# Altium schematic sheet deel2.SchDoc
size A4; SheetNumber: 2; SheetTotal: 3
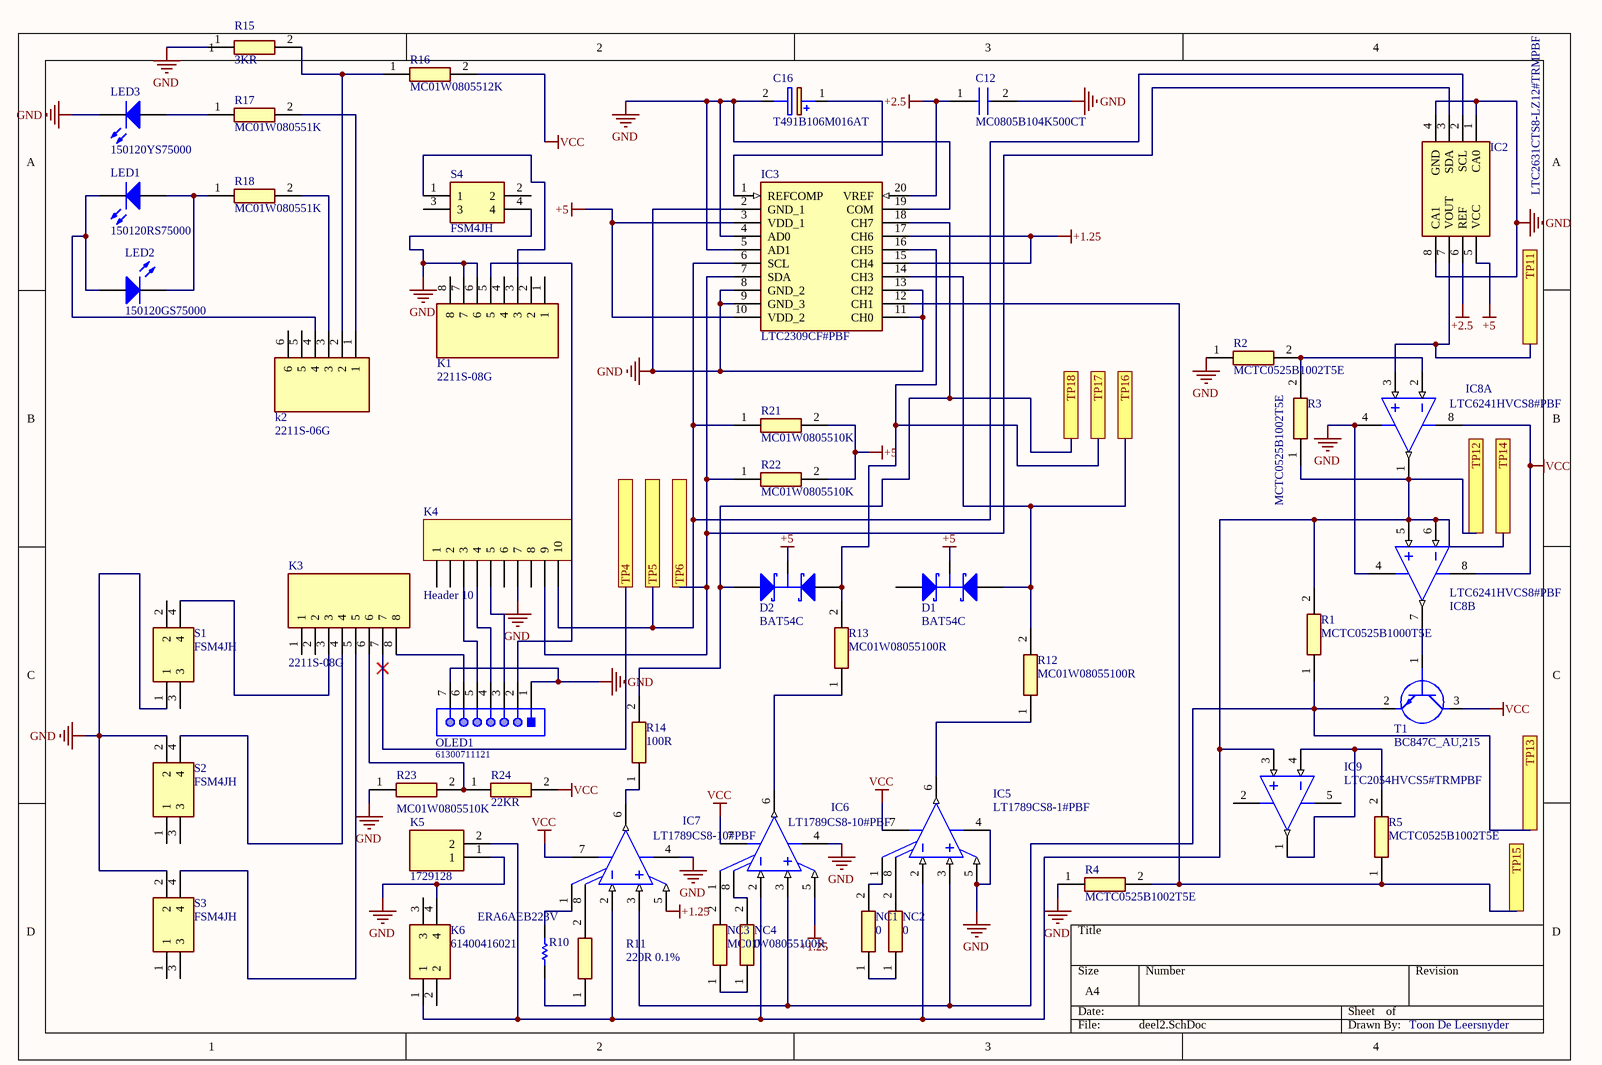
[diagram p0: deel2.SchDoc]

## Parts
C12  MC0805B104K500CT  [CAPC2012X90N]
C16  T491B106M016AT  [CAPPM3528X210N]
D1  BAT54C  [NXP-SOT23-3_V]
D2  BAT54C  [NXP-SOT23-3_V]
IC2  LTC2631CTS8-LZ12#TRMPBF  [SOT65P280X100-8N]
IC3  LTC2309CF#PBF  [SOP65P640X110-20N]
IC5  LT1789CS8-1#PBF  [LT-S8-8_N]
IC6  LT1789CS8-10#PBF  [LT-S8-8_N]
IC7  LT1789CS8-10#PBF  [LT-S8-8_N]
IC8  LTC6241HVCS8#PBF  [LT-S8-8_M]  (parts A,B of 2)
IC9  LTC2054HVCS5#TRMPBF  [LT-S5-5-TSOT-23_N]
K1  2211S-08G  [HDRV8W64P0X254_1X8_2032X254X874P]
k2  2211S-06G  [HDRV6W64P0X254_1X6_1524X254X1774P]
K3  2211S-08G  [HDRV8W64P0X254_1X8_2032X254X874P]
K4  Header 10  [HDR1X10]
K5  1729128  [HDRV2W110P0X508_1X2_1016X810X1000P]
K6  61400416021  [USB-2.0-TYPE-A]
LED1  150120RS75000  [1206_A]
LED2  150120GS75000  [1206_A]
LED3  150120YS75000  [1206_A]
NC1  0  [RESC2014X65N]
NC2  0  [RESC2014X65N]
NC3  MC01W08055100R  [RESC2014X65N]
NC4  0  [RESC2014X65N]
OLED1  61300711121  [61300711121]
R1  MCTC0525B1000T5E  [RESC2012X65N]
R2  MCTC0525B1002T5E  [RESC2012X65N]
R3  MCTC0525B1002T5E  [RESC2012X65N]
R4  MCTC0525B1002T5E  [RESC2012X65N]
R5  MCTC0525B1002T5E  [RESC2012X65N]
R10  ERA6AEB223V  [RESC2013X60X40ML20T25]
R11  220R 0.1%  [RESC2014X65N]
R12  MC01W08055100R  [RESC2014X65N]
R13  MC01W08055100R  [RESC2014X65N]
R14  100R  [RESC2014X65N]
R15  3KR  [RESC2014X65N]
R16  MC01W0805512K  [RESC2014X65N]
R17  MC01W080551K  [RESC2014X65N]
R18  MC01W080551K  [RESC2014X65N]
R21  MC01W0805510K  [RESC2014X65N]
R22  MC01W0805510K  [RESC2014X65N]
R23  MC01W0805510K  [RESC2014X65N]
R24  22KR  [RESC2014X65N]
S1  FSM4JH  [FSM4JH]
S2  FSM4JH  [FSM4JH]
S3  FSM4JH  [FSM4JH]
S4  FSM4JH  [FSM4JH]
T1  BC847C_AU,215  [SOT95P230X110-3N]

## Ports
TP4, TP5, TP6, TP11, TP12, TP13, TP14, TP15, TP16, TP17, TP18

## Nets
+1.25: IC3.15(CH4) IC3.17(CH6) IC6.5(REF) IC7.5(REF)
+2.5: C12.1 IC2.6(REF) IC3.20(VREF)
+5: D1.3(K) D2.3(K) IC2.5(VCC) IC3.3(VDD_1) IC3.10(VDD_2) R21.2 R22.2
GND: C12.2 C16.2(-) IC2.1(CA0) IC2.4(GND) IC2.8(CA1) IC3.2(GND_1) IC3.4(AD0) IC3.5(AD1) IC3.8(GND_2) IC3.9(GND_3) IC3.11(CH0) IC3.13(CH2) IC3.19(COM) IC5.4(-VS) IC5.5(REF) IC6.4(-VS) IC7.4(-VS) IC8.4(V-) K1.6 K1.7 K4.7 K5.1 K6.4 LED3.1(K) OLED1.1 OLED1.7 R2.1 R4.1 R15.1 R23.1 S1.1 S2.2 S3.2 S4.4
VCC: IC5.7(+VS) IC6.7(+VS) IC7.7(+VS) IC8.8(V+) R16.2 R24.2 T1.3(C)
TP4: K3.7 ; port TP4
TP5: IC2.2(SCL) IC3.6(SCL) K4.10 R21.1 ; port TP5
TP6: IC2.3(SDA) IC3.7(SDA) K4.9 R22.1 ; port TP6
TP11: IC2.7(VOUT) IC8.3(+IN_A) ; port TP11
TP12: IC5.2(-IN) IC6.2(-IN) IC7.2(-IN) IC8.1(OUT_A) IC8.5(+IN_B) IC8.6(-IN_B) IC9.3(+IN) K5.2 K6.1 R1.2 R3.1 ; port TP12, port TP14
TP13: IC5.3(+IN) IC6.3(+IN) IC7.3(+IN) R1.1 T1.2(E) ; port TP13
TP15: IC3.12(CH1) R4.2 R5.1 ; port TP15
TP16: D1.2(A) IC3.14(CH3) R12.2 ; port TP16
TP17: D2.2(A) IC3.16(CH5) R13.2 ; port TP17
TP18: D2.1(A) IC3.18(CH7) R14.2 ; port TP18
NetC16_1: C16.1(+) IC3.1(REFCOMP)
NetIC5_1: IC5.1(RG) NC1.2
NetIC5_6: IC5.6(OUT) R12.1
NetIC5_8: IC5.8(RG) NC2.2
NetIC6_1: IC6.1(RG) NC3.2
NetIC6_6: IC6.6(OUT) R13.1
NetIC6_8: IC6.8(RG) NC4.2
NetIC7_1: IC7.1(RG) R10.2
NetIC7_6: IC7.6(OUT) R14.1
NetIC7_8: IC7.8(RG) R11.2
NetIC8_2: IC8.2(-IN_A) R2.2 R3.2
NetIC8_7: IC8.7(OUT_B) T1.1(B)
NetIC9_1: IC9.1(OUT) IC9.4(-IN) R5.2
NetK1_3: K1.3 S4.1
NetK1_5: K1.5 OLED1.2
Netk2_1: k2.1 R17.2
Netk2_2: k2.2 R15.2 R16.1
Netk2_3: k2.3 R18.2
Netk2_4: k2.4 LED1.1(K) LED2.2(A)
NetK3_3: K3.3 S1.4
NetK3_4: K3.4 S2.4
NetK3_5: K3.5 S3.4
NetK3_6: K3.6 R23.2 R24.1
NetK3_8: K3.8 OLED1.6
NetK4_3: K4.3 OLED1.5
NetK4_4: K4.4 OLED1.4
NetK4_5: K4.5 OLED1.3
NetLED1_2: LED1.2(A) LED2.1(K) R18.1
NetLED3_2: LED3.2(A) R17.1
NetNC1_1: NC1.1 NC2.1
NetNC3_1: NC3.1 NC4.1
NetR10_1: R10.1 R11.1

Not connected (* = marked no-connect by the designer): D1 1(A); IC9 2(V-) 5(V+); K1 1 2 4 8; k2 5 6; K3 1 2; K4 1 2 6 8; K6 2 3; S1 2 3; S2 1 3; S3 1 3; S4 2 3

## Notes on the sheet
- Toon De Leersnyder

## Library data of the parts
C12 = MC0805B104K500CT: Capacitor; Manufacturer_Name: MULTICOMP; Datasheet Link: https://componentsearchengine.com/Datasheets/2/MC0805B104K500CT.pdf; Height: 0.9mm; Manufacturer_Part_Number: MC0805B104K500CT
C16 = T491B106M016AT: Capacitor Polarised; Manufacturer_Name: Kemet; Datasheet Link: https://componentsearchengine.com/Datasheets/2/T491B106M016AT.pdf; Height: 2.1mm; Manufacturer_Part_Number: T491B106M016AT; Mouser Part Number: 80-T491B106M016; Mouser Price/Stock: https://www.mouser.co.uk/ProductDetail/KEMET/T491B106M016AT?qs=WydH9nGI6cAnkEyQJLjSzA%3D%3D; Arrow Part Number: T491B106M016AT; Arrow Price/Stock: https://www.arrow.com/en/products/t491b106m016at/kemet-corporation
D1 D2 = CMP-0417-00003-1: Schottky Barrier Diode, 30 V, 2 uA, -55 to 150 degC, 3-Pin SOT23, RoHS, Tape and Reel; Manufacturer: NXP Semiconductors; IR (uA): 2; VF (mV): 800; Trr (ns): 5; Cd (pF): 10; VR (V): 30; Rth(j-a) (K/W): 500; RoHS: TRUE; Packing: Tape and Reel; ComponentLink2URL: http://www.nxp.com/documents/data_sheet/BAT54_SER.pdf; PartNumber: BAT54C; ComponentLink2Description: Datasheet; Temperature Range: -55 to 150 degC; PackageReference: SOT23-3; PackageDescription: 3-Pin Plastic Surface-mounted Package, Body 1.3 x 2.9 mm, Pitch 0.95 mm; Mounting Technology: Surface Mount; ComponentLink1URL: http://www.nxp.com/; DatasheetVersion: Rev. 5; ComponentLink1Description: Manufacturer URL
IC2 = LTC2631CTS8-LZ12#TRMPBF: Integrated Circuit; Manufacturer_Name: Analog Devices; Datasheet Link: https://www.analog.com/media/en/technical-documentation/data-sheets/2631fd.pdf; Height: 1mm; Manufacturer_Part_Number: LTC2631CTS8-LZ12#TRMPBF; Mouser Part Number: 584-2631CTS8LZ12TMPF; Mouser Price/Stock: https://www.mouser.co.uk/ProductDetail/Analog-Devices/LTC2631CTS8-LZ12TRMPBF?qs=hVkxg5c3xu%252BAZArayp8N8g%3D%3D; Arrow Part Number: LTC2631CTS8-LZ12#TRMPBF; Arrow Price/Stock: https://www.arrow.com/en/products/ltc2631cts8-lz12trmpbf/analog-devices
IC3 = LTC2309CF#PBF: Integrated Circuit; Manufacturer_Name: Linear Technology; Datasheet Link: http://docs-emea.rs-online.com/webdocs/10c2/0900766b810c2cad.pdf; Height: 1.1mm; Manufacturer_Part_Number: LTC2309CF#PBF; Mouser Part Number: 584-LTC2309CF#PBF; Mouser Price/Stock: https://www.mouser.com/Search/Refine.aspx?Keyword=584-LTC2309CF%23PBF; Arrow Part Number: LTC2309CF#PBF; Arrow Price/Stock: https://www.arrow.com/en/products/ltc2309cfpbf/linear-technology
IC5 = CMP-0359-03660-2: Single Channel, Micropower, Single Supply Rail-to-Rail Output Instrumentation Amplifiers, 0.06 MHz Typical GBW, 0.026 V/us Typical SR, 2.2 to 36 V, 8-Pin SOIC (S8-8), Commercial, Pb-Free; Manufacturer: Linear Technology; Linear Technology Part Number: LT1789-1; Vos (mV) Typical: 0.15; Vs Max (V): 36; Vos (mV) Guaranteed: 0.75; Is (mA) Typical: 0.067; SR (V/us) Typical: 0.026; Vs Min (V): 2.2; Channels (#): 1; GBW (MHz) Typical: 0.06; PackageVersion: Rev G; ComponentLink1URL: http://www.linear.com/; ComponentLink2URL: http://cds.linear.com/docs/en/datasheet/1789fc.pdf; RoHS: Pb-Free; Mounting Technology: Surface Mount; RevisionNote: URLs updated; ComponentLink3URL: http://cds.linear.com/docs/en/packaging/05081610_G_SO8.pdf; PartNumber: LT1789CS8-1#PBF; DatasheetVersion: Rev. C; ComponentLink3Description: Package Specification; ComponentLink2Description: Datasheet; ComponentLink1Description: Manufacturer URL; Type: IA; PackageDescription: 8-Pin Plastic Small Outline, Body 4.9 x 3.9 mm, Pitch 1.27 mm; PackageReference: LT-S8-8
IC6 IC7 = CMP-0359-03644-3: Single Channel, Micropower, Single Supply Rail-to-Rail Output Instrumentation Amplifiers, 0.06 MHz Typical GBW, 0.026 V/us Typical SR, 2.2 to 36 V, 8-Pin SOIC (S8-8), Commercial, Pb-Free; Manufacturer: Linear Technology; Linear Technology Part Number: LT1789-10; Vos (mV) Typical: 0.65; SR (V/us) Typical: 0.026; GBW (MHz) Typical: 0.06; Channels (#): 1; Is (mA) Typical: 0.067; Vs Max (V): 36; Vos (mV) Guaranteed: 3; Vs Min (V): 2.2; PartNumber: LT1789CS8-10#PBF; PackageDescription: 8-Pin Plastic Small Outline, Body 4.9 x 3.9 mm, Pitch 1.27 mm; Mounting Technology: Surface Mount; ComponentLink1URL: http://www.linear.com/; DatasheetVersion: Rev. C; ComponentLink2Description: Datasheet; RoHS: Pb-Free; ComponentLink3Description: Package Specification; Type: IA; PackageReference: LT-S8-8; RevisionNote: URLs updated; ComponentLink1Description: Manufacturer URL; ComponentLink2URL: http://cds.linear.com/docs/en/datasheet/1789fc.pdf; ComponentLink3URL: http://cds.linear.com/docs/en/packaging/05081610_G_SO8.pdf; PackageVersion: Rev G
IC8 = CMP-0359-02698-2: Dual Channel, Low Noise, CMOS Operational Amplifier, RRO, 18 MHz Typical GBW, 10 V/us Typical SR, 2.8 to 12 V, 8-Pin SOIC (S8-8), Commercial, Pb-Free; Manufacturer: Linear Technology; SR (V/us) Typical: 10; Vs Min (V): 2.8; Is (mA) Typical: 1.8; Channels (#): 2; GBW (MHz) Typical: 18; Vos (mV) Typical: 0.04; Vs Max (V): 12; Type: VFB; RoHS: Pb-Free; ComponentLink3Description: Package Specification; DatasheetVersion: Rev. E; ComponentLink1Description: Manufacturer URL; RevisionNote: URLs updated; ComponentLink2Description: Datasheet; ComponentLink3URL: http://cds.linear.com/docs/en/packaging/05081610_G_SO8.pdf; Mounting Technology: Surface Mount; PackageDescription: 8-Pin Plastic Small Outline, Body 4.9 x 3.9 mm, Pitch 1.27 mm; PackageVersion: Rev G; Linear Technology Part Number: LTC6241HV; ComponentLink2URL: http://cds.linear.com/docs/en/datasheet/624012fe.pdf; PartNumber: LTC6241HVCS8#PBF; PackageReference: LT-S8-8; ComponentLink1URL: http://www.linear.com/
IC9 = CMP-0359-02161-2: Single Channel, Micropower Zero-Drift Operational Amplifier, 0.5 MHz Typical GBW, 0.5 V/us Typical SR, 2.7 to 11 V, 5-Pin SOT23 (S5-5), Commercial, Pb-Free, Mini Reel; Manufacturer: Linear Technology; Vs Min (V): 2.7; Vos (mV) Typical: 0.0005; SR (V/us) Typical: 0.5; Channels (#): 1; Vs Max (V): 11; Is (mA) Typical: 0.15; ComponentLink1URL: http://www.linear.com/; ComponentLink1Description: Manufacturer URL; Packing: Mini Reel; PackageReference: LT-S5-5-TSOT-23; ComponentLink3URL: http://cds.linear.com/docs/en/packaging/SOT_5_05-08-1635.pdf; Type: ZD; PackageDescription: 5-Lead Plastic TSOT-23, Body 1.63 x 2.90 mm, Pitch 0.95 mm; RoHS: Pb-Free; RevisionNote: URLs updated; ComponentLink2URL: http://cds.linear.com/docs/en/datasheet/20545fc.pdf; Code_JEDEC: MO-193; PartNumber: LTC2054HVCS5#TRMPBF; GBW (MHz) Typical: 0.5; DatasheetVersion: Rev. C; Mounting Technology: Surface Mount; Linear Technology Part Number: LTC2054HV; ComponentLink2Description: Datasheet; ComponentLink3Description: Package Specification
K1 K3 = 2211S-08G: Connector; Manufacturer_Name: MULTICOMP; Datasheet Link: https://componentsearchengine.com/Datasheets/2/2211S-08G.pdf; Height: 8.74mm; Manufacturer_Part_Number: 2211S-08G
k2 = 2211S-06G: Connector; Manufacturer_Name: MULTICOMP; Datasheet Link: http://www.farnell.com/datasheets/1518407.pdf; Height: 17.74mm; Manufacturer_Part_Number: 2211S-06G
K4 = Header 10: Header, 10-Pin; LatestRevisionDate: 17-Jul-2002; LatestRevisionNote: Re-released for DXP Platform.; Publisher: Altium Limited
K5 = 1729128: Connector; Manufacturer_Name: Phoenix Contact; Datasheet Link: http://docs-emea.rs-online.com/webdocs/1380/0900766b81380189.pdf; Height: 10mm; Manufacturer_Part_Number: 1729128; Mouser Part Number: 651-1729128; Mouser Price/Stock: https://www.mouser.co.uk/ProductDetail/Phoenix-Contact/1729128/?qs=GFUSqQMLmmnCBVBY3dts9w%3D%3D; Arrow Part Number: 1729128; Arrow Price/Stock: https://www.arrow.com/en/products/1729128/phoenix-contact
K6 = 61400416021: Connector; Manufacturer_Name: Wurth Elektronik; Datasheet Link: http://katalog.we-online.de/em/datasheet/61400416021.pdf; Manufacturer_Part_Number: 61400416021; Mouser Part Number: 710-61400416021; Mouser Price/Stock: https://www.mouser.co.uk/ProductDetail/Wurth-Elektronik/61400416021/?qs=rS3zZhy2AQM1ZldAqz%2FFOw%3D%3D
LED1 = CMP-1426-00013-1: SMD mono-color Chip LED, WL-SMCW, Red; Manufacturer: Wuerth Elektronik; Color: Red; ComponentLink2URL: http://katalog.we-online.com/led/datasheet/150120RS75000.pdf; ComponentLink2Description: Datasheet; ComponentLink1Description: Manufacturer URL; ComponentLink1URL: http://www.we-online.com; PartNumber: 150120RS75000; PackageReference: 1206_A
LED2 = CMP-1426-00014-1: SMD mono-color Chip LED, WL-SMCW, Green; Manufacturer: Wuerth Elektronik; PackageReference: 1206_A; PartNumber: 150120GS75000; ComponentLink1Description: Manufacturer URL; ComponentLink2URL: http://katalog.we-online.com/led/datasheet/150120GS75000.pdf; ComponentLink2Description: Datasheet; Color: Green; ComponentLink1URL: http://www.we-online.com
LED3 = CMP-1426-00019-1: SMD mono-color Chip LED, WL-SMCW, Yellow; Manufacturer: Wuerth Elektronik; ComponentLink2URL: http://katalog.we-online.com/led/datasheet/150120YS75000.pdf; PartNumber: 150120YS75000; ComponentLink1URL: http://www.we-online.com; Color: Yellow; ComponentLink1Description: Manufacturer URL; PackageReference: 1206_A; ComponentLink2Description: Datasheet
NC1-NC4 R11-R15 R24 = MC01W08055100R: Resistor; Manufacturer_Name: MULTICOMP; Datasheet Link: http://www.farnell.com/datasheets/1729047.pdf; Height: 0.65mm; Manufacturer_Part_Number: MC01W08055100R
OLED1 = CMP-1502-01074-1: THT Vertical Pin Header WR-PHD, Pitch 2.54 mm, Single Row, 7 pins; Manufacturer: Wurth Elektronik; Pin Number: 7; Gender: Male; Working Voltage: 250VAC; Contact Resistance: 20mOhm; Rated Current: 3A; Pitch: 2.54mm; Withstanding Voltage: 500VAC; Row Number: Single; Packaging: Bag; Orientation: Vertical; Manufacturer URL: http://www.we-online.de; Datasheet URL: https://katalog.we-online.de/em/datasheet/6130xx11121.pdf; Part Number: 61300711121; Publisher: WurthElektronik; Operating Temperature: -40to105degC; Mounting Technology: THT; Package Reference: 61300711121
R1 = MCTC0525B1000T5E: Resistor; Manufacturer_Name: MULTICOMP; Datasheet Link: https://componentsearchengine.com/Datasheets/2/MCTC0525B1001T5E.pdf; Height: 0.65mm; Manufacturer_Part_Number: MCTC0525B1000T5E
R2-R5 = MCTC0525B1002T5E: Resistor; Manufacturer_Name: MULTICOMP; Datasheet Link: https://componentsearchengine.com/Datasheets/2/MCTC0525B1001T5E.pdf; Height: 0.65mm; Manufacturer_Part_Number: MCTC0525B1002T5E
R10 = CMP-2001-00614-1: Manufacturer: Panasonic; Part Number: ERA6AEB223V
R16 = MC01W0805512K: Resistor; Manufacturer_Name: MULTICOMP; Datasheet Link: http://www.farnell.com/datasheets/1729047.pdf; Height: 0.65mm; Manufacturer_Part_Number: MC01W0805512K
R17 R18 = MC01W080551K: Resistor; Manufacturer_Name: MULTICOMP; Datasheet Link: http://www.farnell.com/datasheets/1729047.pdf; Height: 0.65mm; Manufacturer_Part_Number: MC01W080551K
R21-R23 = MC01W0805510K: Resistor; Manufacturer_Name: MULTICOMP; Datasheet Link: http://www.farnell.com/datasheets/1729047.pdf; Height: 0.65mm; Manufacturer_Part_Number: MC01W0805510K
S1-S4 = FSM4JH: Switch; Manufacturer_Name: TE Connectivity; Datasheet Link: http://www.te.com/commerce/DocumentDelivery/DDEController?Action=showdoc&DocId=Customer+Drawing%7F1825910%7FC9%7Fpdf%7FEnglish%7FENG_CD_1825910_C9.pdf%7F1825910-6; Manufacturer_Part_Number: FSM4JH; Mouser Part Number: 506-FSM4JH; Mouser Price/Stock: https://www.mouser.co.uk/ProductDetail/TE-Connectivity-Alcoswitch/FSM4JH/?qs=g%252BEszo6zu8OwVWrHD2r3Rw%3D%3D; Arrow Part Number: FSM4JH; Arrow Price/Stock: https://www.arrow.com/en/products/fsm4jh/te-connectivity
T1 = BC847C_AU,215: Transistor BJT NPN; Manufacturer_Name: Nexperia; Manufacturer_Part_Number: BC847C/AU,215; Datasheet Link: http://assets.nexperia.com/documents/data-sheet/BC847_SER.pdf; Height: 1.1mm